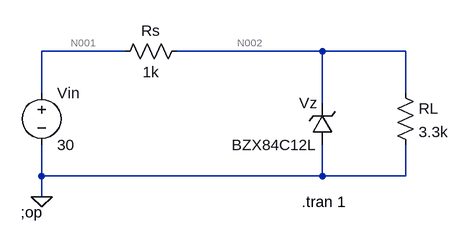
[diagram p0: schematic EEE_3.asc]
EEE_3.asc, the LTspice schematic file:
Version 4
SHEET 1 880 680
WIRE 176 64 48 64
WIRE 480 64 256 64
WIRE 608 64 480 64
WIRE 48 128 48 64
WIRE 608 128 608 64
WIRE 480 144 480 64
WIRE 48 256 48 208
WIRE 480 256 480 208
WIRE 480 256 48 256
WIRE 608 256 608 208
WIRE 608 256 480 256
WIRE 48 288 48 256
FLAG 48 288 0
SYMBOL voltage 48 112 R0
SYMATTR InstName Vin
SYMATTR Value 30
SYMBOL res 272 48 R90
WINDOW 0 0 56 VBottom 2
WINDOW 3 32 56 VTop 2
SYMATTR InstName Rs
SYMATTR Value 1k
SYMBOL res 592 112 R0
SYMATTR InstName RL
SYMATTR Value 3.3k
SYMBOL zener 496 208 R180
WINDOW 0 24 64 Left 2
WINDOW 3 24 0 Left 2
SYMATTR InstName Vz
SYMATTR Value BZX84C12L
TEXT 16 312 Left 2 !;op
TEXT 448 296 Left 2 !.tran 1

The netlist it stands for:
* EEE_3.asc
Vin N001 0 30
Rs N002 N001 1k
RL N002 0 3.3k
D§Vz 0 N002 BZX84C12L
.model D D
.lib standard.dio
;op
.tran 1
.backanno
.end

* Results of the author's LTspice run, read from the files saved beside the schematic
* Operating Point, zero values left out:
*   V(n001) = 30 V
*   V(n002) = 12.35 V
*   I(Vz) = -13.91 mA
*   I(Rl) = 3.742 mA
*   I(Rs) = -17.65 mA
*   I(Vin) = -17.65 mA